# Altium project ECSE478 - DAQ Device.PrjPcb (part 4 of 4)
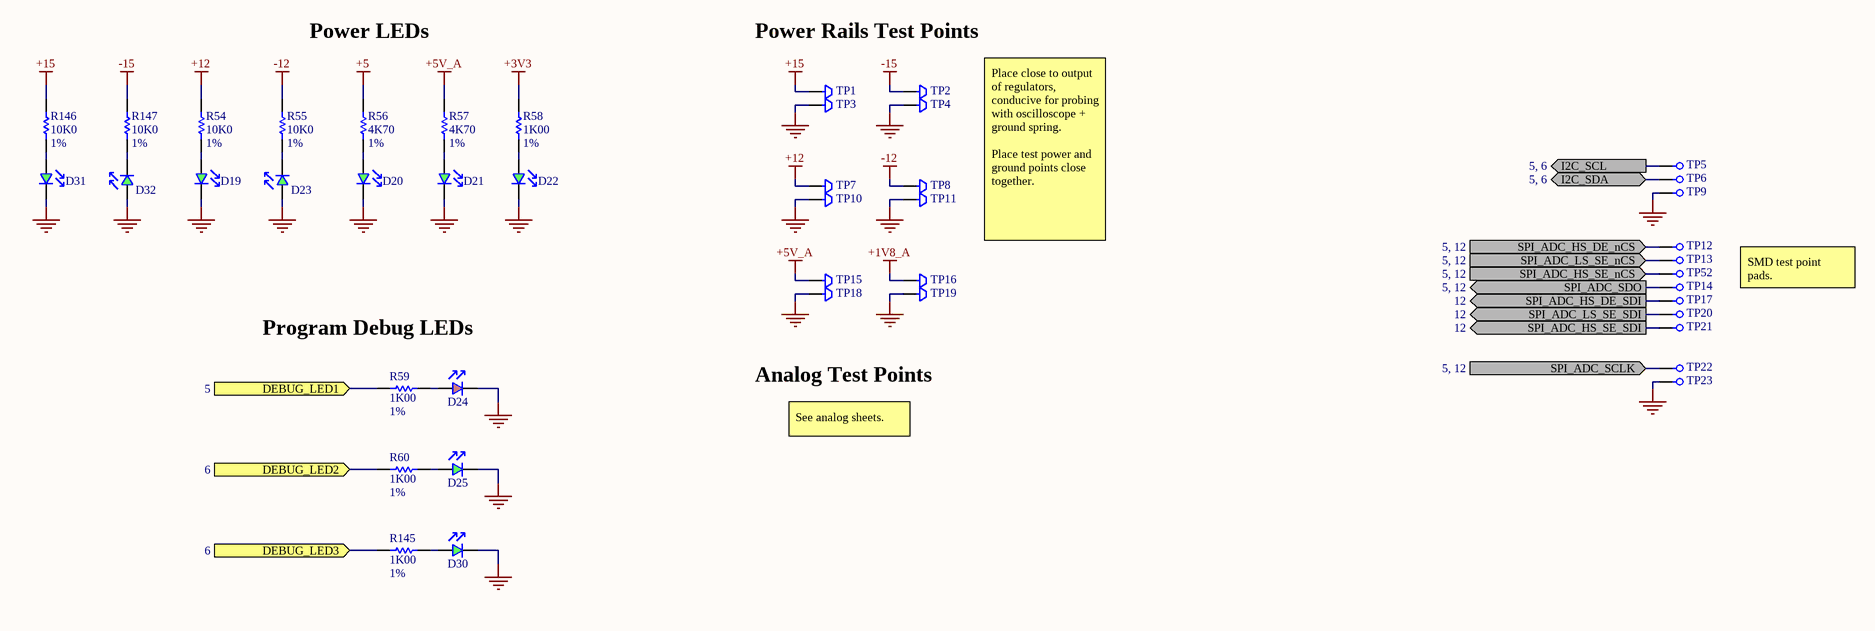
[diagram p13: Debug.SchDoc]

## Nets that join several sheets
+1V8_A: Power (C16.2 C17.2 U14.5), ADC (9 pins), Debug (TP16.1)
+3V3: Connectors - Analog (P8.2), Power (5 pins), Microcontroller (R19.1 R20.1 R21.1 U18.46), IO Expansion (14 pins), Digital IO Protection (16 pins), ADC (16 pins), Debug (R58.2)
+5: Connectors - Analog (P4.2), Connectors - Digital (F1.2), Power (11 pins), Microcontroller (R195.2 TP53.1), Debug (R56.2)
+5_FILT: Power (C112.2 R148.2), Analog - High Speed SE (R75.1), Analog - High Speed DE (R103.1), Analog - Low Speed SE (R112.1)
+5V_A: Power (R10.2 R11.1 U15.1), Analog - High Speed SE (R76.1), Analog - High Speed DE (R102.1), Analog - Low Speed SE (R111.1), ADC (9 pins), Debug (R57.2 TP15.1)
+12: Connectors - Analog (P3.2), Power (7 pins), Analog - High Speed SE (12 pins), Analog - High Speed DE (14 pins), Analog - Low Speed SE (16 pins), Debug (R54.2 TP7.1)
+15: Power (6 pins), Debug (R146.2 TP1.1)
-12: Connectors - Analog (P7.2), Power (C29.2 C106.2 D33.2 U16.1), Analog - High Speed SE (10 pins), Analog - High Speed DE (12 pins), Analog - Low Speed SE (14 pins), Debug (R55.2 TP8.1)
-15: Power (8 pins), Debug (R147.2 TP2.1)
GND: Connectors - Analog (40 pins), Connectors - Digital (33 pins), Power (50 pins), Microcontroller (8 pins), IO Expansion (16 pins), Digital IO Protection (16 pins), Relay Drivers (24 pins), Analog - High Speed SE (32 pins), Analog - High Speed DE (38 pins), Analog - Low Speed SE (62 pins), ADC (27 pins), Debug (18 pins)
AIN_HS_DE_1_N: Connectors - Analog (J2.8 P16.1), Analog - High Speed DE (D52.2 R157.1)
AIN_HS_DE_1_P: Connectors - Analog (J2.20 P16.2), Analog - High Speed DE (D50.2 R161.1)
AIN_HS_DE_2_N: Connectors - Analog (J2.22 P18.1), Analog - High Speed DE (D48.2 R158.1)
AIN_HS_DE_2_P: Connectors - Analog (J2.9 P18.2), Analog - High Speed DE (D46.2 R162.1)
AIN_HS_DE_3_N: Connectors - Analog (J2.11 P22.1), Analog - High Speed DE (D51.2 R159.1)
AIN_HS_DE_3_P: Connectors - Analog (J2.23 P22.2), Analog - High Speed DE (D49.2 R163.1)
AIN_HS_DE_4_N: Connectors - Analog (J2.25 P24.1), Analog - High Speed DE (D47.2 R160.1)
AIN_HS_DE_4_P: Connectors - Analog (J2.12 P24.2), Analog - High Speed DE (D45.2 R164.1)
AIN_HS_DE_FILTERED: Analog - High Speed DE (C76.2 R105.1 TP48.1), ADC (U42.3)
AIN_HS_SE_1: Connectors - Analog (J2.14 P15.2), Analog - High Speed SE (D44.2 R149.1)
AIN_HS_SE_2: Connectors - Analog (J2.2 P15.1), Analog - High Speed SE (D40.2 R150.1)
AIN_HS_SE_3: Connectors - Analog (J2.3 P17.2), Analog - High Speed SE (D43.2 R151.1)
AIN_HS_SE_4: Connectors - Analog (J2.16 P17.1), Analog - High Speed SE (D39.2 R152.1)
AIN_HS_SE_5: Connectors - Analog (J2.17 P21.2), Analog - High Speed SE (D42.2 R153.1)
AIN_HS_SE_6: Connectors - Analog (J2.5 P21.1), Analog - High Speed SE (D38.2 R154.1)
AIN_HS_SE_7: Connectors - Analog (J2.6 P23.2), Analog - High Speed SE (D41.2 R155.1)
AIN_HS_SE_8: Connectors - Analog (J2.19 P23.1), Analog - High Speed SE (D37.2 R156.1)
AIN_HS_SE_FILTERED: Analog - High Speed SE (C54.2 R78.1 TP45.1), ADC (U41.3)
AIN_LS_MUX_1_EN: Microcontroller (R131.2), Analog - Low Speed SE (R203.1 U35.2)
AIN_LS_MUX_2_EN: Microcontroller (R132.2), Analog - Low Speed SE (R204.1 U38.2)
AIN_LS_MUX_3_EN: Microcontroller (R133.2), Analog - Low Speed SE (R205.1 U40.2)
AIN_LS_MUX_SELECT_A0: Microcontroller (R130.2), Analog - Low Speed SE (U36.1)
AIN_LS_MUX_SELECT_A1: Microcontroller (R134.2), Analog - Low Speed SE (U36.16)
AIN_LS_SE_1: Connectors - Analog (J1.20 P1.2), Analog - Low Speed SE (D60.2 R165.1)
AIN_LS_SE_2: Connectors - Analog (J1.2 P1.1), Analog - Low Speed SE (D56.2 R166.1)
AIN_LS_SE_3: Connectors - Analog (J1.3 P5.2), Analog - Low Speed SE (D59.2 R167.1)
AIN_LS_SE_4: Connectors - Analog (J1.22 P5.1), Analog - Low Speed SE (D55.2 R168.1)
AIN_LS_SE_5: Connectors - Analog (J1.23 P9.2), Analog - Low Speed SE (D58.2 R169.1)
AIN_LS_SE_6: Connectors - Analog (J1.5 P9.1), Analog - Low Speed SE (D54.2 R170.1)
AIN_LS_SE_7: Connectors - Analog (J1.6 P11.2), Analog - Low Speed SE (D57.2 R171.1)
AIN_LS_SE_8: Connectors - Analog (J1.25 P11.1), Analog - Low Speed SE (D53.2 R172.1)
AIN_LS_SE_9: Connectors - Analog (J1.26 P2.2), Analog - Low Speed SE (D68.2 R173.1)
AIN_LS_SE_10: Connectors - Analog (J1.8 P2.1), Analog - Low Speed SE (D64.2 R174.1)
AIN_LS_SE_11: Connectors - Analog (J1.9 P6.2), Analog - Low Speed SE (D67.2 R175.1)
AIN_LS_SE_12: Connectors - Analog (J1.28 P6.1), Analog - Low Speed SE (D63.2 R176.1)
AIN_LS_SE_13: Connectors - Analog (J1.29 P10.2), Analog - Low Speed SE (D66.2 R177.1)
AIN_LS_SE_14: Connectors - Analog (J1.11 P10.1), Analog - Low Speed SE (D62.2 R178.1)
AIN_LS_SE_15: Connectors - Analog (J1.12 P12.2), Analog - Low Speed SE (D65.2 R179.1)
AIN_LS_SE_16: Connectors - Analog (J1.31 P12.1), Analog - Low Speed SE (D61.2 R180.1)
AIN_LS_SE_17: Connectors - Analog (J1.32), Analog - Low Speed SE (D76.2 R181.1)
AIN_LS_SE_18: Connectors - Analog (J1.14), Analog - Low Speed SE (D72.2 R182.1)
AIN_LS_SE_19: Connectors - Analog (J1.15), Analog - Low Speed SE (D75.2 R183.1)
AIN_LS_SE_20: Connectors - Analog (J1.34), Analog - Low Speed SE (D71.2 R184.1)
AIN_LS_SE_21: Connectors - Analog (J1.35), Analog - Low Speed SE (D74.2 R185.1)
AIN_LS_SE_22: Connectors - Analog (J1.17), Analog - Low Speed SE (D70.2 R186.1)
AIN_LS_SE_23: Connectors - Analog (J1.18), Analog - Low Speed SE (D73.2 R187.1)
AIN_LS_SE_24: Connectors - Analog (J1.37), Analog - Low Speed SE (D69.2 R188.1)
AIN_LS_SE_FILTERED: Analog - Low Speed SE (C79.2 R110.1 TP49.1), ADC (U43.3)
AIN_MUX_HS_DE_A0: Microcontroller (R13.1), Analog - High Speed DE (U30.1)
AIN_MUX_HS_DE_A1: Microcontroller (R12.1), Analog - High Speed DE (U30.16)
AIN_MUX_HS_SE_A0: Microcontroller (R127.2), Analog - High Speed SE (U25.1)
AIN_MUX_HS_SE_A1: Microcontroller (R126.2), Analog - High Speed SE (U25.16)
AIN_MUX_HS_SE_A2: Microcontroller (R125.2), Analog - High Speed SE (U25.15)
AIN_MUX_LS_SE_A0: Microcontroller (R137.2), Analog - Low Speed SE (U35.1 U38.1 U40.1)
AIN_MUX_LS_SE_A1: Microcontroller (R136.2), Analog - Low Speed SE (U35.16 U38.16 U40.16)
AIN_MUX_LS_SE_A2: Microcontroller (R135.2), Analog - Low Speed SE (U35.15 U38.15 U40.15)
DEBUG_LED1: Microcontroller (U18.42), Debug (R59.2)
DEBUG_LED2: IO Expansion (U21.15), Debug (R60.2)
DEBUG_LED3: IO Expansion (U21.16), Debug (R145.2)
DIO_1: Connectors - Digital (J4.14 P39.1), Digital IO Protection (R22.1)
DIO_1_PROT: Microcontroller (U18.2), Digital IO Protection (R26.1)
DIO_2: Connectors - Digital (J4.2 P39.2), Digital IO Protection (R30.1)
DIO_2_PROT: Microcontroller (U18.3), Digital IO Protection (R33.1)
DIO_3: Connectors - Digital (J4.3 P41.1), Digital IO Protection (R36.1)
DIO_3_PROT: Microcontroller (U18.16), Digital IO Protection (R39.1)
DIO_4: Connectors - Digital (J4.16 P41.2), Digital IO Protection (R42.1)
DIO_4_PROT: Microcontroller (U18.17), Digital IO Protection (R45.1)
DIO_5: Connectors - Digital (J4.17 P45.1), Digital IO Protection (R48.1)
DIO_5_PROT: Microcontroller (U18.18), Digital IO Protection (R51.1)
DIO_6: Connectors - Digital (J4.5 P45.2), Digital IO Protection (R23.1)
DIO_6_PROT: Microcontroller (U18.19), Digital IO Protection (R27.1)
DIO_7: Connectors - Digital (J4.6 P47.1), Digital IO Protection (R31.1)
DIO_7_PROT: Microcontroller (U18.20), Digital IO Protection (R34.1)
DIO_8: Connectors - Digital (J4.19 P47.2), Digital IO Protection (R37.1)
DIO_8_PROT: Microcontroller (U18.21), Digital IO Protection (R40.1)
DIO_9: Connectors - Digital (J4.20 P40.1), Digital IO Protection (R43.1)
DIO_9_PROT: Microcontroller (U18.22), Digital IO Protection (R46.1)
DIO_10: Connectors - Digital (J4.8 P40.2), Digital IO Protection (R49.1)
DIO_10_PROT: Microcontroller (U18.23), Digital IO Protection (R52.1)
HS_DE_GAIN_MUX_A0: Microcontroller (R15.1), Analog - High Speed DE (U34.1)
HS_DE_GAIN_MUX_A1: Microcontroller (R14.1), Analog - High Speed DE (U34.16)
HS_SE_GAIN_MUX_A0: Microcontroller (R129.2), Analog - High Speed SE (U28.1)
HS_SE_GAIN_MUX_A1: Microcontroller (R128.2), Analog - High Speed SE (U28.16)
I2C_SCL: Microcontroller (R19.2 U18.41), IO Expansion (U20.19 U21.19 U22.19 U23.19), Debug (TP5.1)
I2C_SDA: Microcontroller (R20.2 U18.40), IO Expansion (U20.20 U21.20 U22.20 U23.20), Debug (TP6.1)
INT: Microcontroller (U18.10), IO Expansion (R61.2 U21.7)
IO_EXPANSION_DIO1: Connectors - Digital (J4.9 P42.1), Digital IO Protection (R24.1)
IO_EXPANSION_DIO1_PROT: IO Expansion (U21.9), Digital IO Protection (R28.1)
IO_EXPANSION_DIO2: Connectors - Digital (J4.22 P42.2), Digital IO Protection (R32.1)
IO_EXPANSION_DIO2_PROT: IO Expansion (U21.10), Digital IO Protection (R35.1)
IO_EXPANSION_DIO3: Connectors - Digital (J4.23 P46.1), Digital IO Protection (R38.1)
IO_EXPANSION_DIO3_PROT: IO Expansion (U21.11), Digital IO Protection (R41.1)
IO_EXPANSION_DIO4: Connectors - Digital (J4.11 P46.2), Digital IO Protection (R44.1)
IO_EXPANSION_DIO4_PROT: IO Expansion (U21.12), Digital IO Protection (R47.1)
IO_EXPANSION_DIO5: Connectors - Digital (J4.12), Digital IO Protection (R25.1)
IO_EXPANSION_DIO5_PROT: IO Expansion (U21.13), Digital IO Protection (R29.1)
IO_EXPANSION_DIO6: Connectors - Digital (J4.25), Digital IO Protection (R50.1)
IO_EXPANSION_DIO6_PROT: IO Expansion (U21.14), Digital IO Protection (R53.1)
LS_SE_GAIN_MUX_A0: Microcontroller (R138.2), Analog - Low Speed SE (U39.1)
LS_SE_GAIN_MUX_A1: Microcontroller (R139.2), Analog - Low Speed SE (U39.16)
nRESET: Microcontroller (U18.9), IO Expansion (5 pins)
RELAY_COIL_PWR_IN_CH_1: Connectors - Digital (J3.20 P27.1), Relay Drivers (U1.6)
RELAY_COIL_PWR_IN_CH_2: Connectors - Digital (J3.2 P27.2), Relay Drivers (U1.3)
RELAY_COIL_PWR_IN_CH_3: Connectors - Digital (J3.3 P29.1), Relay Drivers (U2.6)
RELAY_COIL_PWR_IN_CH_4: Connectors - Digital (J3.22 P29.2), Relay Drivers (U2.3)
RELAY_COIL_PWR_IN_CH_5: Connectors - Digital (J3.23 P31.1), Relay Drivers (U3.6)
RELAY_COIL_PWR_IN_CH_6: Connectors - Digital (J3.5 P31.2), Relay Drivers (U3.3)
RELAY_COIL_PWR_IN_CH_7: Connectors - Digital (J3.6 P33.1), Relay Drivers (U4.6)
RELAY_COIL_PWR_IN_CH_8: Connectors - Digital (J3.25 P33.2), Relay Drivers (U4.3)
RELAY_COIL_PWR_IN_CH_9: Connectors - Digital (J3.26 P35.1), Relay Drivers (U5.6)
RELAY_COIL_PWR_IN_CH_10: Connectors - Digital (J3.8 P35.2), Relay Drivers (U5.3)
RELAY_COIL_PWR_IN_CH_11: Connectors - Digital (J3.9 P28.1), Relay Drivers (U6.6)
RELAY_COIL_PWR_IN_CH_12: Connectors - Digital (J3.28 P28.2), Relay Drivers (U6.3)
RELAY_COIL_PWR_IN_CH_13: Connectors - Digital (J3.29 P30.1), Relay Drivers (U7.6)
RELAY_COIL_PWR_IN_CH_14: Connectors - Digital (J3.11 P30.2), Relay Drivers (U7.3)
RELAY_COIL_PWR_IN_CH_15: Connectors - Digital (J3.12 P32.1), Relay Drivers (U8.6)
RELAY_COIL_PWR_IN_CH_16: Connectors - Digital (J3.31 P32.2), Relay Drivers (U8.3)
RELAY_COIL_PWR_IN_CH_17: Connectors - Digital (J3.32 P34.1), Relay Drivers (U9.6)
RELAY_COIL_PWR_IN_CH_18: Connectors - Digital (J3.14 P34.2), Relay Drivers (U9.3)
RELAY_COIL_PWR_IN_CH_19: Connectors - Digital (J3.15 P36.1), Relay Drivers (U10.6)
RELAY_COIL_PWR_IN_CH_20: Connectors - Digital (J3.34 P36.2), Relay Drivers (U10.3)
RELAY_COIL_PWR_IN_CH_21: Connectors - Digital (J3.35), Relay Drivers (U11.3)
RELAY_COIL_PWR_IN_CH_22: Connectors - Digital (J3.17), Relay Drivers (U11.6)
RELAY_COIL_PWR_IN_CH_23: Connectors - Digital (J3.18), Relay Drivers (U12.3)
RELAY_COIL_PWR_IN_CH_24: Connectors - Digital (J3.37), Relay Drivers (U12.6)
RELAY_DRIVER_EN_CH_1: IO Expansion (U20.9), Relay Drivers (U1.2)
RELAY_DRIVER_EN_CH_2: IO Expansion (U20.10), Relay Drivers (U1.5)
RELAY_DRIVER_EN_CH_3: IO Expansion (U20.11), Relay Drivers (U2.2)
RELAY_DRIVER_EN_CH_4: IO Expansion (U20.12), Relay Drivers (U2.5)
RELAY_DRIVER_EN_CH_5: IO Expansion (U20.13), Relay Drivers (U3.2)
RELAY_DRIVER_EN_CH_6: IO Expansion (U20.14), Relay Drivers (U3.5)
RELAY_DRIVER_EN_CH_7: IO Expansion (U20.15), Relay Drivers (U4.2)
RELAY_DRIVER_EN_CH_8: IO Expansion (U20.16), Relay Drivers (U4.5)
RELAY_DRIVER_EN_CH_9: IO Expansion (U22.9), Relay Drivers (U5.2)
RELAY_DRIVER_EN_CH_10: IO Expansion (U22.10), Relay Drivers (U5.5)
RELAY_DRIVER_EN_CH_11: IO Expansion (U22.11), Relay Drivers (U6.2)
RELAY_DRIVER_EN_CH_12: IO Expansion (U22.12), Relay Drivers (U6.5)
RELAY_DRIVER_EN_CH_13: IO Expansion (U22.13), Relay Drivers (U7.2)
RELAY_DRIVER_EN_CH_14: IO Expansion (U22.14), Relay Drivers (U7.5)
RELAY_DRIVER_EN_CH_15: IO Expansion (U22.15), Relay Drivers (U8.2)
RELAY_DRIVER_EN_CH_16: IO Expansion (U22.16), Relay Drivers (U8.5)
RELAY_DRIVER_EN_CH_17: IO Expansion (U23.9), Relay Drivers (U9.2)
RELAY_DRIVER_EN_CH_18: IO Expansion (U23.10), Relay Drivers (U9.5)
RELAY_DRIVER_EN_CH_19: IO Expansion (U23.11), Relay Drivers (U10.2)
RELAY_DRIVER_EN_CH_20: IO Expansion (U23.12), Relay Drivers (U10.5)
RELAY_DRIVER_EN_CH_21: IO Expansion (U23.13), Relay Drivers (U11.5)
RELAY_DRIVER_EN_CH_22: IO Expansion (U23.14), Relay Drivers (U11.2)
RELAY_DRIVER_EN_CH_23: IO Expansion (U23.15), Relay Drivers (U12.5)
RELAY_DRIVER_EN_CH_24: IO Expansion (U23.16), Relay Drivers (U12.2)
SDI_HS_DE: ADC (P50.1 R121.1 U42.9), Debug (TP17.1)
SDI_HS_SE: ADC (P49.1 R119.1 U41.9), Debug (TP21.1)
SDI_LS_SE: ADC (P51.1 R122.1 U43.9), Debug (TP20.1)
SPI_ADC_HS_DE_nCS: Microcontroller (R17.1), ADC (R120.1 U42.6), Debug (TP12.1)
SPI_ADC_HS_SE_nCS: Microcontroller (R189.1), ADC (R118.1 U41.6), Debug (TP52.1)
SPI_ADC_LS_SE_nCS: Microcontroller (R16.1), ADC (R123.1 U43.6), Debug (TP13.1)
SPI_ADC_SCLK: Microcontroller (R18.2), ADC (U41.8 U42.8 U43.8), Debug (TP22.1)
SPI_ADC_SDO: Microcontroller (U18.14), ADC (R141.1 U41.7 U42.7 U43.7), Debug (TP14.1)

## Assembly variants
Production: not fitted C33 C54 C58 C59 C62 C76 C79 R2 R9 R61 R75 R84 R87 R88 R103 R112 R141